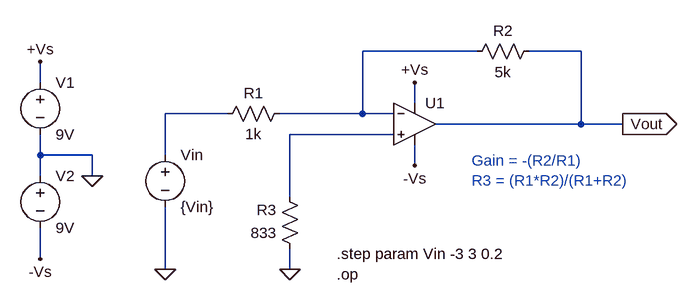
[diagram p0: schematic inverting-opamp.asc]
inverting-opamp.asc, the LTspice schematic file:
Version 4
SHEET 1 880 680
WIRE 464 128 288 128
WIRE 624 128 544 128
WIRE -208 176 -208 144
WIRE 368 208 368 176
WIRE 80 224 -16 224
WIRE 288 224 288 128
WIRE 288 224 160 224
WIRE 336 224 288 224
WIRE 624 240 624 128
WIRE 624 240 400 240
WIRE 688 240 624 240
WIRE 336 256 176 256
WIRE -208 288 -208 256
WIRE -128 288 -208 288
WIRE -16 288 -16 224
WIRE 368 304 368 272
WIRE -208 320 -208 288
WIRE -128 320 -128 288
WIRE 176 352 176 256
WIRE -208 448 -208 400
WIRE -16 464 -16 368
WIRE 176 464 176 432
FLAG -128 320 0
FLAG -208 448 -Vs
FLAG -208 144 +Vs
FLAG 368 176 +Vs
FLAG 368 304 -Vs
FLAG 688 240 Vout
IOPIN 688 240 Out
FLAG 176 464 0
FLAG -16 464 0
SYMBOL Opamps/UniversalOpamp2 368 240 R0
SYMATTR InstName U1
SYMBOL res 176 208 R90
WINDOW 0 0 56 VBottom 2
WINDOW 3 32 56 VTop 2
SYMATTR InstName R1
SYMATTR Value 1k
SYMBOL res 560 112 R90
WINDOW 0 0 56 VBottom 2
WINDOW 3 32 56 VTop 2
SYMATTR InstName R2
SYMATTR Value 5k
SYMBOL res 192 448 R180
WINDOW 0 36 76 Left 2
WINDOW 3 36 40 Left 2
SYMATTR InstName R3
SYMATTR Value 833
SYMBOL voltage -208 160 R0
SYMATTR InstName V1
SYMATTR Value 9V
SYMBOL voltage -208 304 R0
SYMATTR InstName V2
SYMATTR Value 9V
SYMBOL voltage -16 272 R0
SYMATTR InstName Vin
SYMATTR Value {Vin}
TEXT 456 296 Left 2 ;Gain = -(R2/R1)\nR3 = (R1*R2)/(R1+R2)
TEXT 248 440 Left 2 !.step param Vin -3 3 0.2\n.op

The netlist it stands for:
* inverting-opamp.asc
XU1 N003 N001 +Vs -Vs Vout level.2 Avol=1Meg GBW=10Meg Slew=10Meg ilimit=25m rail=0 Vos=0 phimargin=45 en=0 enk=0 in=0 ink=0 Rin=500Meg  ; pins IN+ IN- V+ V- OUT
R1 N001 N002 1k
R2 Vout N001 5k
R3 0 N003 833
V1 +Vs 0 9V
V2 0 -Vs 9V
Vin N002 0 {Vin}
* Gain = -(R2/R1)
* R3 = (R1*R2)/(R1+R2)
.step param Vin -3 3 0.2
.op
.lib UniversalOpamps2.sub
.backanno
.end